# EAGLE design simple_mockup (EAGLE 9.6.2)
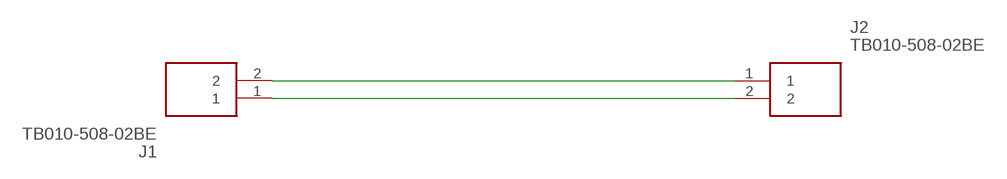
[diagram p0: schematic, sheet 1]

## Parts
J1  TB010-508-02BE  [TB01050802BE]
J2  TB010-508-02BE  [TB01050802BE]

## Nets
N$1: J1.1 J2.2
N$2: J1.2 J2.1

## Library data of the parts
J1 J2 = TB010-508-02BE:TB010-508-02BE: Fixed Terminal Blocks screw type, 5.08 , horizontal, 2 poles, CUI Blue, slotted screw, PCB mount Source: Datasheet <https://www.mouser.be/datasheet/2/670/tb010-508-1550629.pdf>; ARROW_PART_NUMBER: TB010-508-02BE; ARROW_PRICE-STOCK: https://www.arrow.com/en/products/tb010-508-02be/cui-devices; DESCRIPTION: Fixed Terminal Blocks screw type, 5.08 , horizontal, 2 poles, CUI Blue, slotted screw, PCB mount; HEIGHT: 18.6mm; MANUFACTURER_NAME: CUI Devices; MANUFACTURER_PART_NUMBER: TB010-508-02BE; MOUSER_PART_NUMBER: 490-TB010-508-02BE; MOUSER_PRICE-STOCK: https://www.mouser.co.uk/ProductDetail/CUI-Devices/TB010-508-02BE/?qs=vLWxofP3U2zUXV9EmL8T6w%3D%3D

## Board
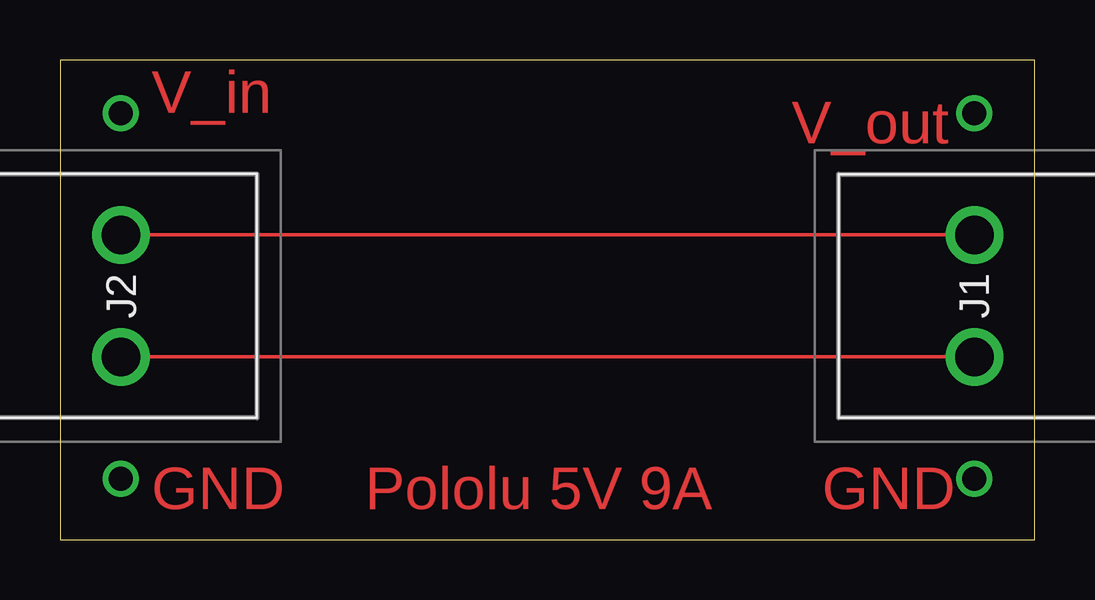
[diagram p1: board, top side]

Size 40.62 x 19.99 mm. Coordinates in mm from the lower left corner, seen from the top.
Outline: 0,0 40.62,0 40.62,19.99 0,19.99 0,0
Copper layers (1*16): Top 0.035mm / dielectric 1.5mm / Bottom 0.035mm
Design rules "default": minimum track width 6mil, minimum drill 0.35mm, track to track 6mil, track to pad 6mil, pad to pad 6mil, via to via 6mil, smd to smd 6mil, copper to edge 40mil, drill to drill 6mil, minimum pad ring 10mil, minimum via ring 8mil, stop-mask expansion 4mil, vias tented up to drill 0mil, thermal gap 10mil

### Footprints (pad centres in the part's own frame; a part is rotated, then mirrored left to right if it is on the bottom)
TB01050802BE = drill 1.6 pad 2.4: 1 0,0; 2 5.08,0

### Placement (x,y rotation side)
J1  38.1,12.7 270 top
J2  2.54,7.62 90 top

### Tracks (layer width: path | path; a pad name or v marks a point on that pad's centre or on a via)
N$1
  Top 0.152: J2.2 J1.1
N$2
  Top 0.152: J2.1 J1.2
N$3  (via drill 1)
  other vias: 2.54,17.78
N$4  (via drill 1)
  other vias: 38.1,17.78
N$5  (via drill 1)
  other vias: 2.54,2.54
N$6  (via drill 1)
  other vias: 38.1,2.54

### Text on the board
Top: V_in | V_out | GND | Pololu 5V 9A | GND